# EAGLE design TG3_1 (EAGLE 7.7.0)
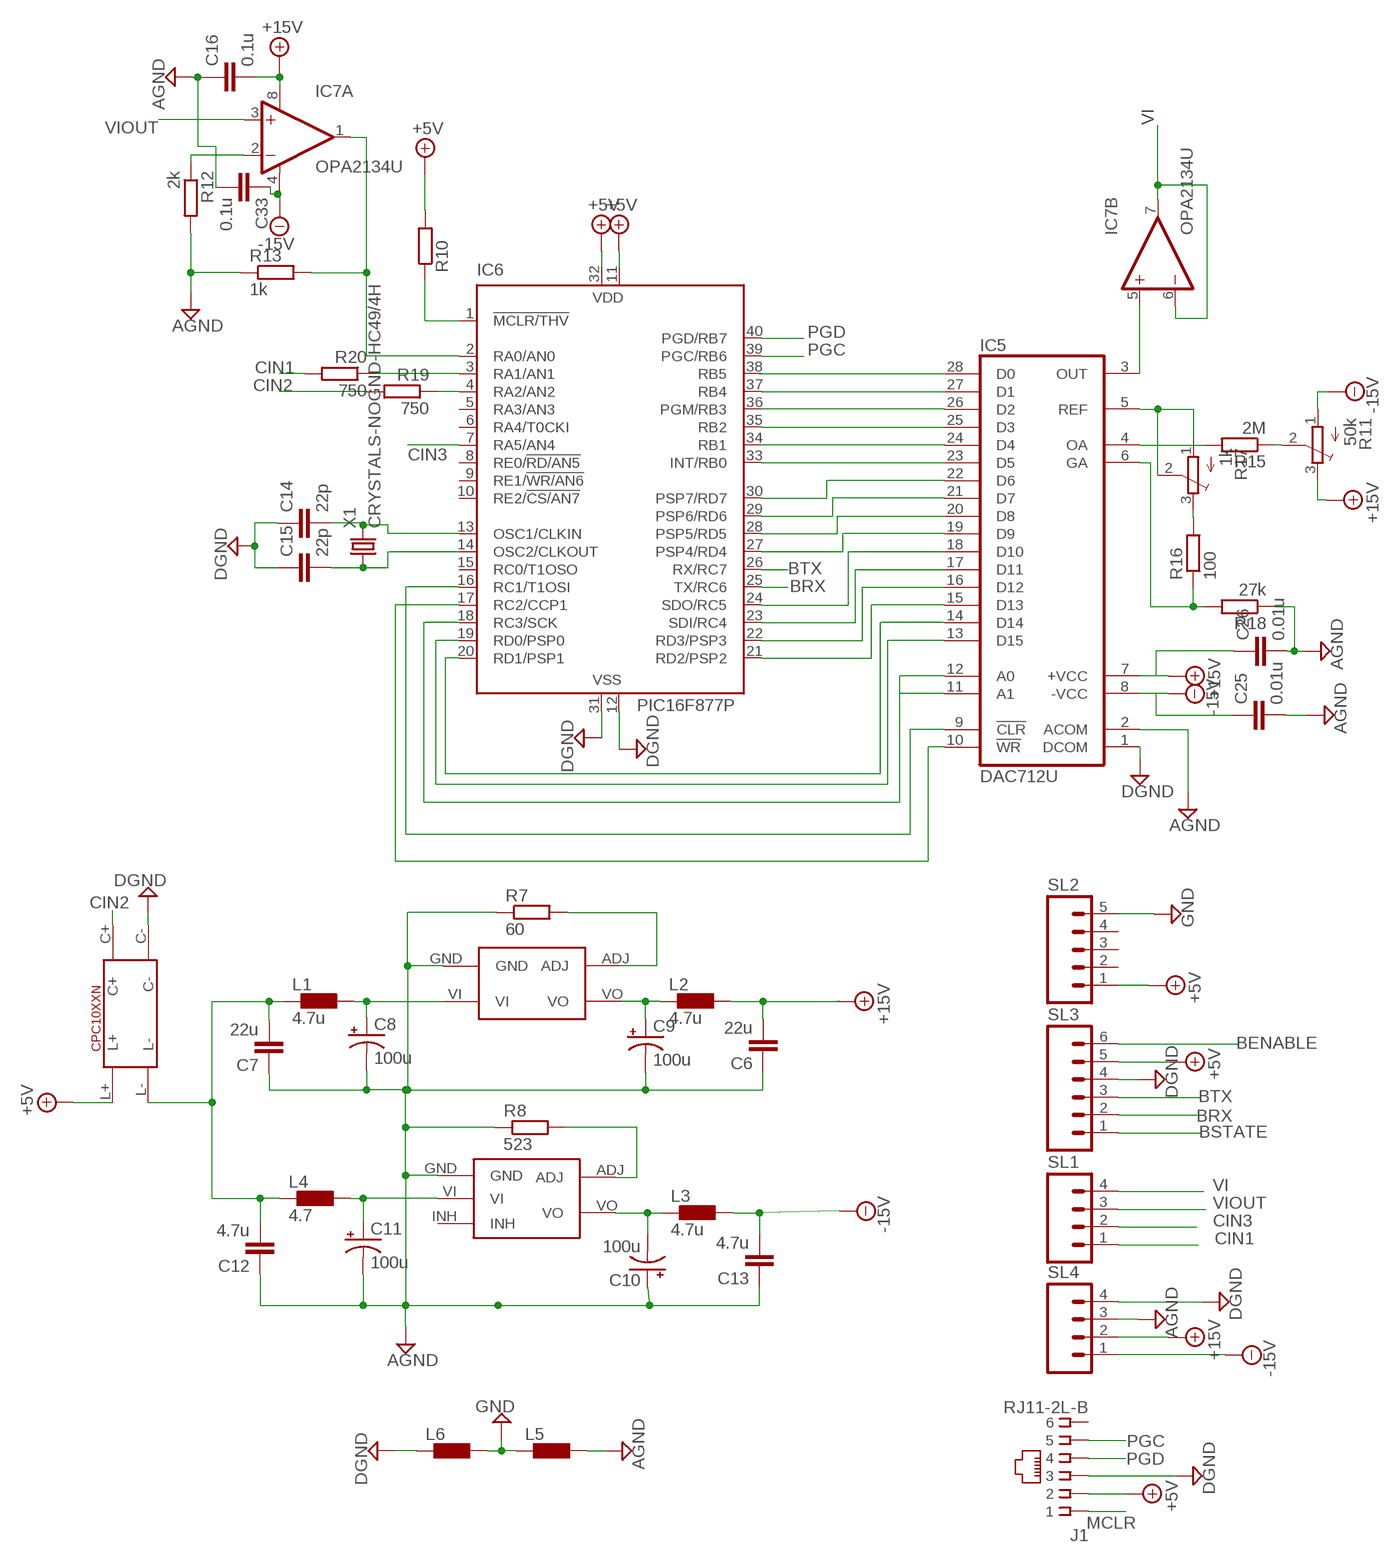
[diagram p0: schematic, sheet 1]

## Parts
C6  22u  C  [C0805]
C7  22u  C  [C0805]
C8  100u  CPOL-US150CLZ-0810  [150CLZ-0810]
C9  100u  CPOL-US150CLZ-0810  [150CLZ-0810]
C10  100u  CPOL-US150CLZ-0810  [150CLZ-0810]
C11  100u  CPOL-US150CLZ-0810  [150CLZ-0810]
C12  4.7u  C  [C0805]
C13  4.7u  C  [C0805]
C14  22p  C  [C0805]
C15  22p  C  [C0805]
C16  0.1u  C  [C0805]
C25  0.01u  C  [C0805]
C26  0.01u  C  [C0805]
C33  0.1u  C  [C0805]
IC5  DAC712U  [SO28-3]
IC6  PIC16F877P  [DIL40]
IC7  OPA2134U  [SO08]
J1  RJ11-2L-B  [RJ11-NO_SHIELD]
L1  4.7u  LL2012C  [L2012C]
L2  4.7u  LL2012C  [L2012C]
L3  4.7u  LL2012C  [L2012C]
L4  4.7  LL2012C  [L2012C]
L5  LL2012C  [L2012C]
L6  LL2012C  [L2012C]
R7  60  R  [R0805]
R8  523  R  [R0805]
R10  R  [R0805]
R11  50k  TRIM_EU-3223W  [3223W]
R12  2k  R  [R0805]
R13  1k  R  [R0805]
R15  2M  R  [R0805]
R16  100  R  [R0805]
R17  1k  TRIM_EU-3223W  [3223W]
R18  27k  R  [R0805]
R19  750  R  [R0805]
R20  750  R  [R0805]
SL1  M04  [04P]
SL2  M05  [05P]
SL3  M06  [06P]
SL4  M04  [04P]
U$1  PTN04050C  [PTN04050C]
U$2  PTN04050A  [PTN04050A]
U$6  CPC10XXN  [CPC10XXN]
X1  CRYSTALS-NOGND-HC49/4H  [HC49]

## Nets
+5V: IC6.11(VDD) IC6.32(VDD) J1.2 R10.2 SL2.1 SL3.5 U$6.L+
+15V: C6.2 C16.2 C26.1 IC5.7(+VCC) IC7.8(A:V+) L2.1 R11.3(E) SL4.2
-15V: C13.2 C25.1 C33.1 IC5.8(-VCC) IC7.4(A:V-) L3.1 R11.1(A) SL4.1
AGND: C6.1 C7.1 C8.- C9.- C10.+ C11.- C12.1 C13.1 C16.1 C25.2 C26.2 C33.2 IC5.2(ACOM) L5.1 R7.1 R8.1 R12.2 R13.1 R18.1 SL4.3 U$1.GND U$2.GND
BENABLE: SL3.6
BRX: IC6.25(TX/RC6) SL3.2
BSTATE: SL3.1
BTX: IC6.26(RX/RC7) SL3.3
CIN1: R20.2 SL1.1
CIN2: R19.2 U$6.C+
CIN3: IC6.7(RA5/AN4) SL1.2
DGND: C14.1 C15.1 IC5.1(DCOM) IC6.12(VSS) IC6.31(VSS) J1.3 L6.2 SL3.4 SL4.4 U$6.C-
GND: L5.2 L6.1 SL2.5
MCLR: IC6.1(!MCLR/THV) J1.1 R10.1
N$1: IC5.21(D7) IC6.29(PSP6/RD6)
N$3: R7.2 U$1.ADJ
N$4: IC5.22(D6) IC6.30(PSP7/RD7)
N$5: C9.+ L2.2 U$1.VO
N$6: IC5.23(D5) IC6.33(INT/RB0)
N$7: C8.+ L1.1 U$1.VI
N$8: C14.2 IC6.13(OSC1/CLKIN) X1.2
N$9: IC5.28(D0)
N$10: C15.2 IC6.14(OSC2/CLKOUT) X1.1
N$11: C11.+ L4.1 U$2.VI
N$12: IC5.24(D4) IC6.34(RB1)
N$13: IC5.25(D3) IC6.35(RB2)
N$14: IC5.26(D2) IC6.36(PGM/RB3)
N$15: C10.- L3.2 U$2.VO
N$17: R8.2 U$2.ADJ
N$18: IC6.3(RA1/AN1) R20.1
N$19: IC5.3(OUT) IC7.5(B:+IN)
N$20: IC6.4(RA2/AN2) R19.1
N$21: IC7.2(A:-IN) R12.1
N$22: IC5.27(D1) IC6.37(RB4)
N$30: IC5.20(D8) IC6.28(PSP5/RD5)
N$31: IC5.19(D9) IC6.27(PSP4/RD4)
N$32: IC5.18(D10) IC6.24(SDO/RC5)
N$33: IC5.17(D11) IC6.23(SDI/RC4)
N$34: IC5.16(D12) IC6.22(RD3/PSP3)
N$35: IC5.15(D13) IC6.21(RD2/PSP2)
N$36: IC5.14(D14) IC6.20(RD1/PSP1)
N$37: IC5.13(D15) IC6.19(RD0/PSP0)
N$38: IC5.11(A1) IC5.12(A0) IC6.18(RC3/SCK)
N$39: C7.2 C12.2 L1.2 L4.2 U$6.L-
N$40: IC5.9(!CLR) IC6.16(RC1/T1OSI)
N$41: IC5.10(!WR) IC6.17(RC2/CCP1)
N$44: R11.2(S) R15.1
N$47: IC5.4(OA) R15.2
N$48: IC5.5(REF) R17.1(A) R17.2(S)
N$49: R16.2 R17.3(E)
N$50: IC5.6(GA) R16.1 R18.2
PGC: IC6.39(PGC/RB6) J1.5
PGD: IC6.40(PGD/RB7) J1.4
VI: IC7.6(B:-IN) IC7.7(B:OUT) SL1.4
VIOUT: IC7.3(A:+IN) SL1.3
VIOUT_IN: IC6.2(RA0/AN0) IC7.1(A:OUT) R13.2
Unconnected: IC6.5(RA3/AN3) IC6.6(RA4/T0CKI) IC6.8(RE0/!RD/AN5) IC6.9(RE1/!WR/AN6) IC6.10(RE2/!CS/AN7) IC6.15(RC0/T1OSO) IC6.38(RB5) J1.6 SL2.2 SL2.3 SL2.4 U$2.INH

## Library data of the parts
C6 C7 C12-C16 C25 C26 C33 = eagle-ltspice:C: CAPACITOR, European symbol; SPICEMODEL: NONE; SPICEPREFIX: C
C8-C11 = resistor:CPOL-US: POLARIZED CAPACITOR, American symbol
IC5 = burr-brown:DAC712: 16-Bit DAC with 16-Bit Bus Interface; MF: TEXAS INSTRUMENTS; MPN: DAC712U; OC_FARNELL: 1097510; OC_NEWARK: 74C9132
IC6 = microchip:PIC16F87*: MICROCONTROLLER; MF: MICROCHIP; MPN: PIC16F877-04/P; OC_FARNELL: 9761349; OC_NEWARK: 61K3463
IC7 = burr-brown:OPA2134: Operational Amplifier; MF: TEXAS INSTRUMENTS; MPN: OPA2134UA; OC_FARNELL: 1206935; OC_NEWARK: 35C1847
J1 = con-tycoelectronics:RJ11: CORCOM Modular RJ Jacks No Shield Source: www.tycoelectronics.com .. ENG_DS_1654001_1099_RJ_L_0507.pdf; MF: TYCO ELECTRONICS; MPN: RJ11-2L-B; OC_FARNELL: unknown; OC_NEWARK: 83F4463
L1-L6 = eagle-ltspice:L: INDUCTOR, European symbol; SPICEMODEL: NONE; SPICEPREFIX: L
R7 R8 R10 R12 R13 R15 R16 R18-R20 = eagle-ltspice:R: RESISTOR, European symbol; SPICEMODEL: NONE; SPICEPREFIX: R
R11 R17 = pot:TRIM_EU-: POTENTIOMETER
SL1 SL4 = con-amp-quick:M04: AMP QUICK CONNECTOR; OC_FARNELL: unknown; OC_NEWARK: unknown
SL2 = con-amp-quick:M05: AMP QUICK CONNECTOR; OC_FARNELL: unknown; OC_NEWARK: unknown
SL3 = con-amp-quick:M06: AMP QUICK CONNECTOR; OC_FARNELL: unknown; OC_NEWARK: unknown
U$1 = Milib:PTN04050C
U$2 = Milib:PTN04050A
U$6 = Milib:CPC10XXN
X1 = IQD-Frequency-Products:CRYSTALS-NOGND: CRYSTALS CAN NOT GROUNDED

## Board
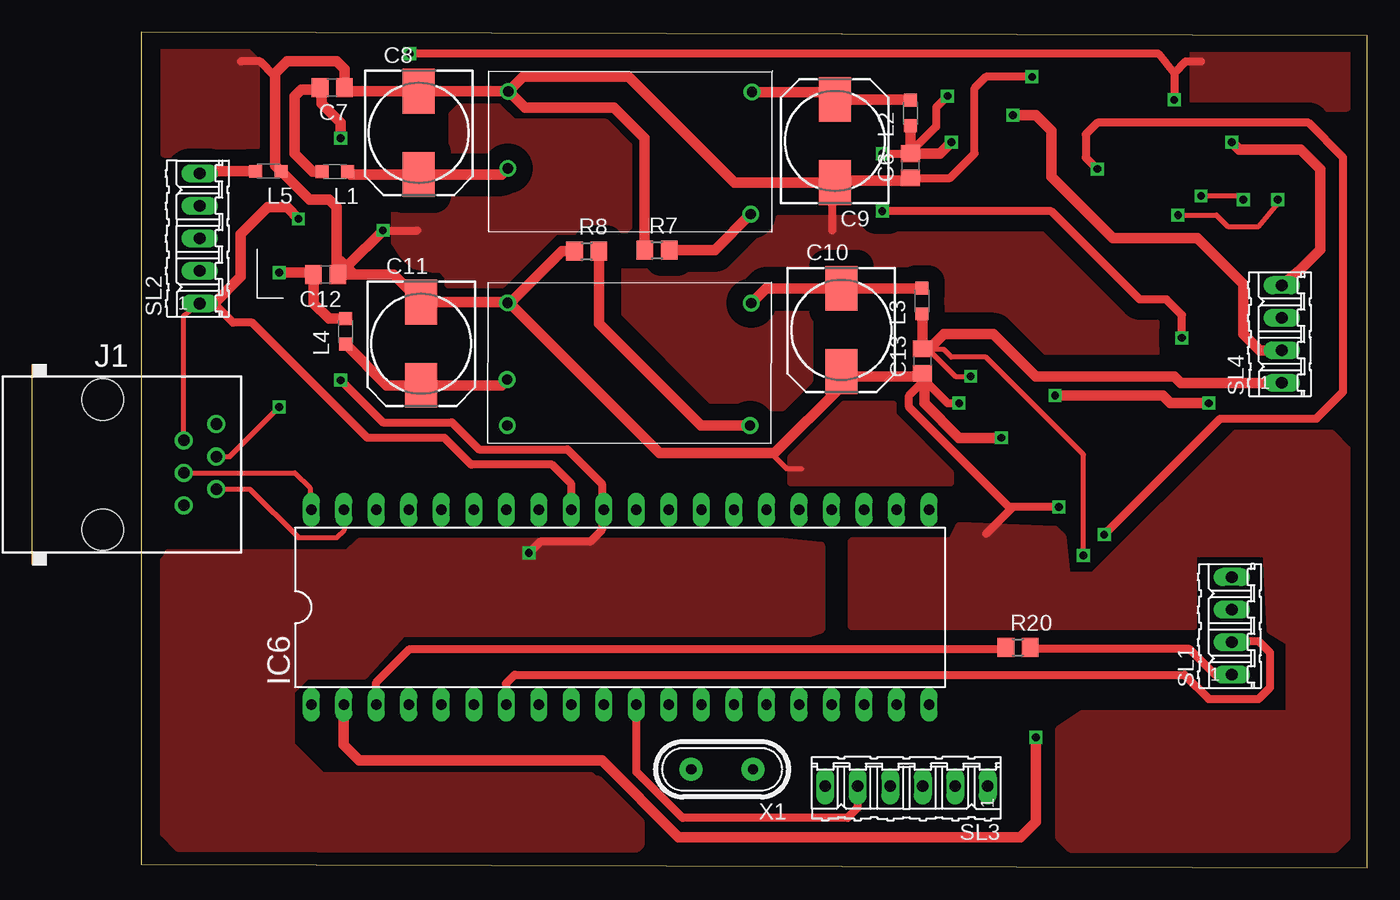
[diagram p1: board, top side]
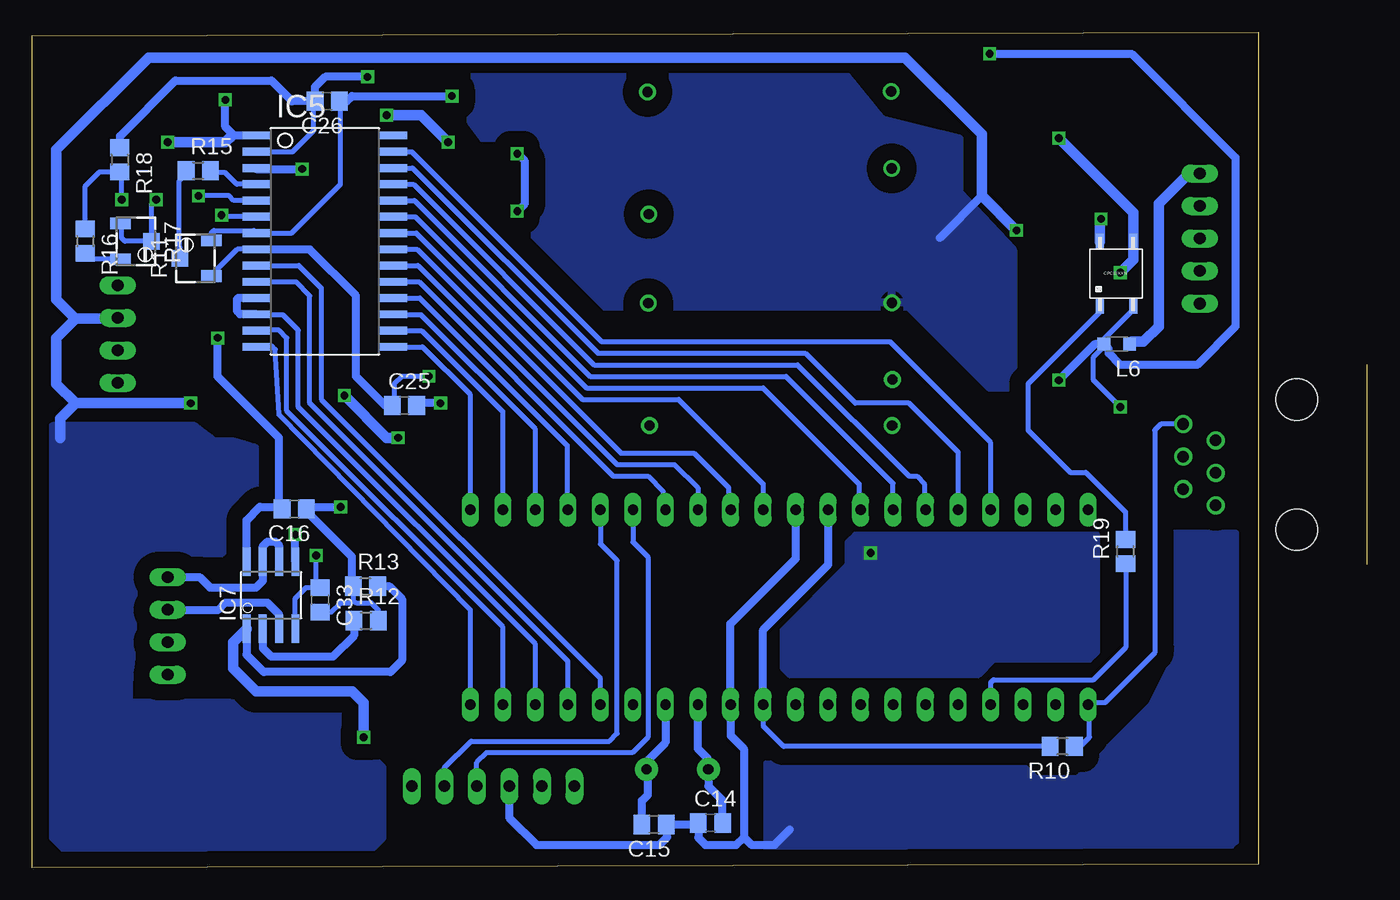
[diagram p2: board, bottom side, seen from below]

Size 95.8 x 65.3 mm. Coordinates in mm from the lower left corner, seen from the top.
Outline: 0,0.3 95.8,0 95.8,65 0,65.3 0,0.3
Copper layers (1*16): Top 0.035mm / dielectric 1.5mm / Bottom 0.035mm
Design rules "default": minimum track width 10mil, minimum drill 24mil, track to track 8mil, track to pad 8mil, pad to pad 8mil, via to via 8mil, smd to smd 8mil, copper to edge 40mil, drill to drill 8mil, minimum pad ring 10mil, minimum via ring 8mil, stop-mask expansion 4mil, vias tented up to drill 0mil, thermal gap 10mil

### Footprints (pad centres in the part's own frame; a part is rotated, then mirrored left to right if it is on the bottom)
C0805 = smd 1.3 x 1.5: 1 -0.95,0; 2 0.95,0
150CLZ-0810 = smd 3.5 x 2.5: + 3.25,0; - -3.25,0
SO28-3 = smd 0.61 x 2.21: 1 -8.255,-5.315; 2 -6.985,-5.315; 3 -5.715,-5.315; 4 -4.445,-5.315; 5 -3.175,-5.315; 6 -1.905,-5.315; 7 -0.635,-5.315; 8 0.635,-5.315; 9 1.905,-5.315; 10 3.175,-5.315; 11 4.445,-5.315; 12 5.715,-5.315; 13 6.985,-5.315; 14 8.255,-5.315; 15 8.255,5.315; 16 6.985,5.315; 17 5.715,5.315; 18 4.445,5.315; 19 3.175,5.315; 20 1.905,5.315; 21 0.635,5.315; 22 -0.635,5.315; 23 -1.905,5.315; 24 -3.175,5.315; 25 -4.445,5.315; 26 -5.715,5.315; 27 -6.985,5.315; 28 -8.255,5.315
DIL40 = drill 0.813 long: 1 -24.13,-7.62; 2 -21.59,-7.62; 3 -19.05,-7.62; 4 -16.51,-7.62; 5 -13.97,-7.62; 6 -11.43,-7.62; 7 -8.89,-7.62; 8 -6.35,-7.62; 9 -3.81,-7.62; 10 -1.27,-7.62; 11 1.27,-7.62; 12 3.81,-7.62; 13 6.35,-7.62; 14 8.89,-7.62; 15 11.43,-7.62; 16 13.97,-7.62; 17 16.51,-7.62; 18 19.05,-7.62; 19 21.59,-7.62; 20 24.13,-7.62; 21 24.13,7.62; 22 21.59,7.62; 23 19.05,7.62; 24 16.51,7.62; 25 13.97,7.62; 26 11.43,7.62; 27 8.89,7.62; 28 6.35,7.62; 29 3.81,7.62; 30 1.27,7.62; 31 -1.27,7.62; 32 -3.81,7.62; 33 -6.35,7.62; 34 -8.89,7.62; 35 -11.43,7.62; 36 -13.97,7.62; 37 -16.51,7.62; 38 -19.05,7.62; 39 -21.59,7.62; 40 -24.13,7.62
SO08 = smd 0.61 x 2.21: 1 -1.905,-2.616; 2 -0.635,-2.616; 3 0.635,-2.616; 4 1.905,-2.616; 5 1.905,2.616; 6 0.635,2.616; 7 -0.635,2.616; 8 -1.905,2.616
RJ11-NO_SHIELD = drill 0.9 pad 1.4: 1 -3.175,8.89; 2 -1.905,6.35; 3 -0.635,8.89; 4 0.635,6.35; 5 1.905,8.89; 6 3.175,6.35 | hole 3.251: -5.08,0; 5.08,0
L2012C = smd 1 x 1: 1 -1,0; 2 1,0
R0805 = smd 1.3 x 1.5: 1 -0.95,0; 2 0.95,0
3223W = smd 0.9 x 1.6: 1 -1.4,-1.215; 3 1.4,-1.215 | smd 1.3 x 1.3: 2 0,1.215
04P = drill 0.914 long: 1 -3.81,0; 2 -1.27,0; 3 1.27,0; 4 3.81,0
05P = drill 0.914 long: 1 -5.08,0; 2 -2.54,0; 3 0,0; 4 2.54,0; 5 5.08,0
06P = drill 0.914 long: 1 -6.35,0; 2 -3.81,0; 3 -1.27,0; 4 1.27,0; 5 3.81,0; 6 6.35,0
PTN04050C = drill 0.8: ADJ 2.765,-6.945; GND -16.17,2.64; VI -16.2,-3.365; VO 2.87,2.605
PTN04050A = drill 0.8: ADJ 2.765,-6.945; GND -16.17,2.64; INH -16.18,-6.96; VI -16.2,-3.365; VO 2.87,2.605
CPC10XXN = smd 0.635 x 1.27: C+ -1.2,-2.5; C- 1.4,-2.5; L+ -1.2,2.5; L- 1.4,2.5
HC49 = drill 0.813 pad 1.8: 1 -2.413,0; 2 2.413,0

### Placement (x,y rotation side)
C6  60.09,54.85 90 top
C7  14.94,60.94 180 top
C8  21.7,57.42 270 top
C9  54.2,56.78 90 top
C10  54.7,42.02 270 top
C11  21.89,40.95 270 top
C12  14.43,46.34 180 top
C13  61.04,39.59 90 top
C14  42.81,3.51 0 bottom
C15  47.21,3.39 180 bottom
C16  75.31,28.04 180 bottom
C25  66.71,36.11 0 bottom
C26  72.74,59.89 180 bottom
C33  73.29,20.93 270 bottom
IC5  72.93,48.96 270 bottom
IC6  37.43,20.36 0 top
IC7  77.14,21.3 0 bottom
J1  -3,31.5 270 top
L1  15.15,54.39 180 top
L2  60.09,58.97 90 top
L3  60.99,44.29 90 top
L4  15.99,41.91 90 top
L5  9.95,54.41 180 top
L6  11.07,40.91 180 bottom
R7  40.3,48.26 0 top
R8  34.81,48.19 0 top
R10  15.34,9.49 180 bottom
R11  83.02,47.63 90 bottom
R12  69.71,19.31 0 bottom
R13  69.76,22.01 0 bottom
R15  82.81,54.46 0 bottom
R16  91.64,48.96 270 bottom
R17  87.68,48.95 270 bottom
R18  88.94,55.31 270 bottom
R19  10.38,24.71 90 bottom
R20  68.51,17.23 0 top
SL1  85.2,18.9 90 top
SL2  4.58,49.17 90 top
SL3  59.79,6.38 180 top
SL4  89.1,41.7 90 top
U$1  44.86,58.01 0 top
U$2  44.8,41.51 0 top
U$6  11.19,46.42 0 bottom
X1  45.39,7.7 180 top

### Tracks (layer width: path | path; a pad name or v marks a point on that pad's centre or on a via)
+5V  (via drill 0.6)
  Top 0.406: J1.2 3.35,43.16 SL2.1
  Top 0.61: IC6.32 33.62,29.98 32.1,31.5 25.8,31.5 23.7,33.6 17.7,33.6 8.7,42.6 7.2,42.6 5.7,44.1 | SL3.5 55.98,4.68 55.2,3.9 42.3,3.9 38.7,7.5 IC6.11
  Top 0.813: v12.3,50.7 11.4,51.6 9.9,51.6 7.8,49.5 7.8,46.2 5.7,44.1 SL2.1
  Bottom 0.406: R10.2 37.09,9.49 38.7,11.1 IC6.11
  Bottom 0.61: IC6.32 33.62,23.68 38.7,18.6 IC6.11
  Bottom 0.813: U$6.L+ 12.39,50.61 v12.3,50.7
+15V  (via drill 0.6)
  Top 0.61: 60.09,57.9 L2.1 60.16,57.9 | 60,55.8 62.1,57.9 62.1,59.4 v63,60.3 | v81.3,41.4 81.3,43.2 80.1,44.4 78,44.4 71.1,51.3 v57.9,51.3 | v57.9,55.8 C6.2
  Top 0.813: C6.2 L2.1 | 60,55.8 C6.2 | v63.3,56.7 62.4,55.8 C6.2 | v68.1,58.8 69.9,58.8 71.1,57.6 71.1,54 75.9,49.2 82.5,49.2 86.1,45.6 86.1,41.7 87.37,40.43 SL4.2
  Bottom 0.406: IC5.7 75.51,49.59 71.7,53.4 71.7,59.8 C26.1 | 78.28,49.63 IC5.7 | R11.3 81.81,49.59 81.6,49.8 78.45,49.8 IC5.7
  Bottom 0.61: C26.1 71.21,59.89 70.8,60.3 v63,60.3 | IC7.8 79.05,27.15 78,28.2 76.8,28.2 | 76.8,28.2 76.4,28.2 C16.2 | 76.8,28.2 76.5,27.9 76.5,33.6 81.3,38.4 v81.3,41.4 | v57.9,51.3 57.3,51.9 57.3,55.2 v57.9,55.8
  Bottom 0.813: v63.3,56.7 65.4,58.8 v68.1,58.8
-15V  (via drill 0.6)
  Top 0.406: v73.61,24.41 73.61,32.29 66,39.9 63.3,39.9 62.7,40.5 61.5,40.5 | 61.38,40.2 C13.2 61.3,40.8 | 61.38,40.2 61.2,40.2 | 61.38,40.2 61.5,40.5 | 61.5,40.5 63.6,38.4 v64.8,38.4
  Top 0.813: L3.1 61.04,43.24 C13.2 61.08,40.5 61.5,40.5 62.7,41.7 66.6,41.7 69.9,38.4 80.7,38.4 81.21,37.89 SL4.1
  Bottom 0.406: IC5.8 79.78,48.32 81.81,46.3 R11.1 | IC7.4 75.23,21.06 74.4,21.9 73.61,21.9 | 73.61,21.9 C33.1 | 73.61,21.9 v73.61,24.41 | v64.8,38.4 66.9,38.4 67.5,37.8 67.5,36.27 C25.1
  Bottom 0.61: C25.1 68.21,36.11 70.5,38.4 70.5,44.7 74.1,48.3 78.22,48.3 IC5.8
AGND  (via drill 0.6)
  Top 0.406: 16.2,46.5 16.5,46.5 | 16.5,46.5 17.7,46.5 18.3,46.2 17.1,46.2 16.5,46.5 | 15.9,46.5 15.3,47.7 | 49.2,32.4 50.4,31.2 51.6,31.2
  Top 0.61: C13.1 61.04,38.26 61.2,38.1 | 61.2,38.1 63,36.3 v63.9,36.3 | C6.1 63.2,53.9 65.1,55.8 65.1,60.9 66,61.8 v69.6,61.8 | 68.1,28.2 67.8,28.2 60,36 60,36.9 61.2,38.1 | v18.9,49.8 21.6,49.8 | 54,53.7 54,53.4 | 54,49.8 54,53.4 | 54,53.4 54.3,53.7 56.7,53.7 | 10.5,58.5 10.5,61.8 9.3,63 7.8,63 | v71.7,28.2 68.1,28.2 | 68.1,28.2 66,26.1
  Top 0.813: C12.1 15.3,46.42 15.3,47.7 15.3,51.6 14.7,52.2 13.16,52.2 L5.1 10.5,54.86 10.5,58.5 10.5,62.1 11.4,63 15.3,63 15.89,62.41 C7.1 16.16,60.67 C8.- 28.67,60.67 U$1.GND | C12.1 19.75,46.34 C11.- 28.58,44.2 U$2.GND | U$1.GND 28.74,60.6 28.8,60.6 30,59.4 36.95,59.4 39.35,57 R7.1 | C10.+ 54.7,37.6 | 54.7,37.6 49.5,32.4 49.2,32.4 40.5,32.4 28.75,44.15 U$2.GND | U$2.GND 28.85,44.15 32.89,48.19 R8.1 | U$1.GND 29.84,61.8 38.1,61.8 46.37,53.53 C9.- 54.37,53.7 56.7,53.7 59.89,53.7 C6.1 | 54.7,37.6 55.2,38.1 54.9,38.4 60.8,38.4 C13.1 | v18.9,49.8 16.2,47.1 16.14,47.1 C12.1 | 16.5,46.5 15.6,47.4 15.6,46.5 15.9,46.5 16.2,46.5 | v67.2,33.6 63.9,33.6 61.2,36.3 61.2,38.1 61.2,38.7 | v71.4,36.9 79.8,36.9 80.4,36.3 v83.4,36.3
  Bottom 0.406: IC5.2 75.46,55.95 73.8,57.6 73.8,59.78 C26.2 | 88.93,55.95 R18.1 | R13.1 70.71,20.91 | 70.71,20.91 70.5,20.7 69.3,20.7 68.76,20.16 R12.2 | C33.2 72.42,19.98 71.7,20.7 70.92,20.7 70.71,20.91
  Bottom 0.61: v63.9,36.3 65.65,36.3 C25.2 | v69.6,61.8 72.9,61.8 73.69,61.01 C26.2 75.49,59.89 77.1,61.5 84.6,61.5 88.93,57.17 88.93,55.95 | R13.1 70.8,22.1 70.8,24.3 74.1,27.6 74.22,27.9 C16.1 73.94,28.04 74.1,28.2 v71.7,28.2 | 92.4,42.9 92.54,43.04 | 21.6,52.5 24.9,49.2 | 89.77,42.9 SL4.3
  Bottom 0.813: 92.54,43.04 93.9,44.4 93.9,56.1 86.7,63.3 27.6,63.3 21.6,57.3 21.6,52.5 v18.9,49.8 | 92.4,36.3 93.9,37.8 93.9,41.4 92.4,42.9 89.77,42.9 | 92.4,36.3 v83.4,36.3 | v71.4,36.9 68.1,33.6 v67.2,33.6 | 92.4,36.3 93.6,35.1 93.6,33.6
  pour Top (isolate 1.27, rank 2): 19.8,48.9 20.4,48 21.3,47.1 22.8,46.8 23.4,46.8 24,46.2 24,45.6 28.2,45.6 32.4,49.8 37.8,49.8 38.1,50.1 38.1,56.4 36.3,58.2 29.1,58.2 27.9,59.4 24.9,59.4 24.3,58.8 24.3,56.1 25.2,55.2 27.3,55.2 28.2,56.1 29.4,56.1 30.3,55.2 30.3,53.4 29.7,52.8 24.6,52.8 23.4,51.6 19.8,51.9
  pour Top (isolate 1.27, rank 2): 37.5,46.5 37.5,42.6 44.1,36 50.1,36 52.2,38.1 52.2,43.2 49.2,43.2 48.3,42.3 47.1,42.3 45.6,43.8 45.6,44.4 48,46.8 51.9,46.8 52.8,47.7 56.4,47.7 57,47.1 61.2,47.1 62.7,45.6 62.7,43.8 63.6,42.9 67.2,42.9 69,41.1 69.9,40.2 79.2,40.2 80.1,41.1 80.1,42.6 79.5,43.2 77.4,43.2 70.5,50.1 59.1,50.1 58.8,49.8 57,49.8 56.1,50.7 49.8,50.7 48.3,49.2 47.1,49.2 45,47.1 43.2,47.1 42.6,46.5
  pour Top (isolate 1.27, rank 2): 1.8,55.8 8.4,55.8 9,56.4 9,63 8.1,63.9 1.8,63.9
  pour Bottom (isolate 1.27, rank 2): 81.6,33.3 81.9,33.6 83.1,34.5 94.2,34.5 94.2,2.4 93.3,1.5 69.3,1.5 68.4,2.4 68.4,7.8 69,8.4 70.5,8.4 71.7,9.6 71.7,12 72.3,12.6 80.4,12.9 88.2,12.9 88.2,14.4 87.3,23.7 86.4,24.6 81,24.6 80.1,25.5 80.1,27.9 78.6,29.4 78.3,29.4 78,29.7 78,32.7 80.1,33.3
  pour Bottom (isolate 1.27, rank 2): 60.6,57 61.5,58.2 61.5,61.8 32.1,61.8 29.4,58.5 23.4,57 23.4,52.8 19.2,48.3 19.2,37.5 21,37.5 27.3,43.8 51,43.8 56.7,49.5 56.1,50.1 56.4,57
  pour Top: 50.7,30.3 50.7,32.1 54.9,36.3 55.8,36.3 58.8,36.3 58.8,35.4 63.3,30.9 63.3,30 50.7,30
  pour Top: 55.5,25.5 55.5,18.9 82.2,18.9 82.2,24.6 87.9,24.6 88.2,18.6 89.7,17.7 89.7,12 73.5,12 71.7,10.8 71.7,2.4 72.6,1.5 93.3,1.5 94.2,2.4 94.2,32.7 93,33.9 85.5,33.9 74.4,22.8 72.3,22.8 72,25.8 71.4,26.4 63.9,26.7 63.3,25.5
BRX
  Bottom 0.406: SL3.2 63.6,7.8 61.5,9.9 50.7,9.9 50.1,10.5 50.1,24 51.4,25.3 IC6.25
BTX
  Bottom 0.406: IC6.26 48.86,25.46 47.7,24.3 47.7,10.2 48.9,9 60.3,9 61.06,8.24 SL3.3
CIN1
  Top 0.61: R20.2 69.59,17.1 81.9,17.1 83.91,15.09 SL1.1
CIN2
  Bottom 0.406: U$6.C+ 12.39,43.41 18,37.8 18,34.2 14.7,30.9 13.5,30.9 10.38,27.78 R19.2
CIN3
  Top 0.61: IC6.7 28.5,12.78 28.5,14.4 29.19,15.09 81.51,15.09 83.4,13.2 87.3,13.2 88.2,14.1 88.2,16.8 87.3,17.7 85.27,17.7 SL1.2
DGND  (via drill 0.6)
  Top 0.406: J1.3 6.94,32.13 v10.8,36
  Top 0.61: 80.7,62.1 79.5,63.6 v21,63.6 | v15.6,38.1 18.9,34.8 24.3,34.8 26.4,32.7 33.3,32.7 36,30 36,28.14 | 36,28.14 IC6.31 | 80.7,62.1 v80.7,60 | 80.7,62.1 81.6,63 82.8,63 | 36,28.14 36,26.4 35.1,25.5 31.2,25.5 v30.3,24.6
  Top 0.813: SL4.4 90.51,46.71 92.1,48.3 92.1,54.6 90.6,56.1 85.8,56.1 v85.2,56.7
  Bottom 0.406: U$6.C- 9.79,43.61 12.07,41.33 L6.2 12.3,40.68 12.3,40.5 12.9,39.9 12.9,38.1 v10.8,36
  Bottom 0.61: 41.24,19.06 36.16,24.14 IC6.31 | IC5.1 80.02,57.21 | 80.02,57.21 80.7,57.9 v80.7,60 | v21,63.6 9.9,63.6 1.8,55.5 1.8,42.3 4.8,39.3 10.8,39.3 11.7,40.2 11.7,40.54 L6.2 12.79,40.91 v15.6,38.1 | SL3.4 58.52,3.92 56.4,1.8 46.8,1.8 46.2,2.4 46.2,3.33 C15.1 43.88,3.39 C14.1 43.76,2.36 43.2,1.8 40.8,1.8 40.2,2.4 | 41.24,19.06 41.26,19.06 | 41.24,19.06 IC6.12 41.24,10.34 40.2,9.3 40.2,2.4 | 40.2,2.4 39.6,1.8 37.8,1.8 36.6,3 | 80.4,57 80.23,57 80.02,57.21
  Bottom 0.813: v85.2,56.7 80.7,56.7 80.4,57
  pour Top (isolate 1.27, rank 2): 82.2,63.6 82.2,59.4 94.2,59.4 94.2,63.9 82.2,63.9
  pour Bottom (isolate 1.27, rank 2): 38.4,8.1 38.4,1.5 2.4,1.5 1.8,2.1 1.8,26.1 6.6,26.1 6.3,16.8 8.4,12.6 14.1,6.9 17.4,6.9 18.6,8.1
  pour Top: 35.4,6.9 35.7,6.9 39,3.6 39,1.8 38.7,1.5 3,1.5 1.8,2.7 1.8,24 2.1,24.3 2.1,24.6 16.2,24.6 17.1,25.5 50.1,25.5 53.1,25.2 53.1,18.6 52.2,18.3 20.4,18.3 17.4,15 12.9,15 11.7,13.8 11.7,9.6 14.1,7.2 35.1,7.2
  pour Bottom: 12.6,16.8 13.2,16.2 20.7,16.2 21.9,15 36.6,15 37.2,15.6 37.2,18.6 32.1,23.7 32.1,25.5 31.5,26.1 12.6,26.1
GND
  Top 0.813: L5.2 4.74,54.41 SL2.5
  Bottom 0.813: SL2.5 5.45,54.25 7.8,51.9 7.8,42.3 9,41.1 9.88,41.1 L6.1
MCLR
  Bottom 0.406: R10.1 13.91,9.49 13.2,10.2 13.2,12.64 IC6.1 13.14,12.9 12,12.9 8.1,16.8 8.1,34.2 7.62,34.67 J1.1
N$1
  Bottom 0.406: IC5.21 65.73,48.32 49.8,32.4 44.1,32.4 41.4,29.7 41.4,28.14 IC6.29
N$3
  Top 0.813: R7.2 44.82,48.26 U$1.ADJ
N$4
  Bottom 0.406: IC5.22 65.8,49.59 52.8,36.6 45.3,36.6 38.7,30 IC6.30
N$5
  Top 0.813: U$1.VO 53.62,60.62 C9.+ 60.03,60.03 L2.2
N$6
  Bottom 0.406: IC5.23 65.87,50.87 52.5,37.5 38.7,37.5 31.2,30 31.2,28.1 IC6.33
N$7
  Top 0.813: U$1.VI 28.18,54.17 C8.+ 16.37,54.17 L1.1
N$8
  Bottom 0.61: IC6.13 43.8,12.72 43.8,9.3 42.98,8.48 X1.2 42.98,6.38 41.86,5.26 C14.2
N$10
  Bottom 0.61: C15.2 48.16,5.24 47.7,5.7 47.7,7.6 X1.1 47.8,8.3 46.32,9.78 IC6.14
N$11
  Top 0.813: U$2.VI 28.15,37.7 C11.+ 19.2,37.7 L4.1
N$12
  Bottom 0.406: IC5.24 65.94,52.13 52.2,38.4 36.9,38.4 28.54,30.04 IC6.34
N$13
  Bottom 0.406: IC5.25 66.01,53.41 51.9,39.3 36,39.3 27.3,30.6 26.7,30.6 26.1,30 26.1,28.08 IC6.35
N$14
  Bottom 0.406: IC5.26 66.08,54.67 51.6,40.2 35.4,40.2 31.5,36.3 27.3,36.3 23.46,32.46 IC6.36
N$15
  Top 0.813: U$2.VO 48.82,45.27 C10.- 60.97,45.27 L3.2
N$17
  Top 0.813: R8.2 35.76,42.54 43.73,34.56 U$2.ADJ
N$18
  Top 0.61: IC6.3 18.38,14.48 21,17.1 67.43,17.1 R20.1
N$19  (via drill 0.6)
  Top 0.61: v75.23,26.04 84.3,35.1 91.8,35.1 93.9,37.2 93.9,55.5 91.2,58.2 74.7,58.2 73.8,57.3 73.8,55.5 v74.7,54.6
  Bottom 0.406: IC5.3 78.08,54.67 78,54.6 78.3,54.6
  Bottom 0.61: 78.3,54.6 v74.7,54.6 | IC7.5 v75.23,26.04
N$20
  Bottom 0.406: IC6.4 20.92,14.48 20.7,14.7 12.9,14.7 10.38,17.22 R19.1
N$21
  Bottom 0.61: R12.1 70.66,18.14 72.3,16.5 77.1,16.5 77.78,17.17 IC7.2
N$22
  Bottom 0.406: IC6.37 20.92,33.22 28.8,41.1 51.3,41.1 66.15,55.95 IC5.27
N$30
  Bottom 0.406: IC5.20 65.66,47.05 50.1,31.5 45.6,31.5 43.8,29.7 43.8,28 IC6.28
N$31
  Bottom 0.406: IC5.19 65.59,45.78 50.4,30.6 47.7,30.6 46.5,29.4 46.5,28.16 IC6.27
N$32
  Bottom 0.406: IC5.18 65.52,44.52 54,33 54,28.04 IC6.24
N$33
  Bottom 0.406: IC6.23 56.48,34.28 65.4,43.2 67.57,43.2 IC5.17
N$34
  Bottom 0.406: IC5.16 65.38,41.98 59.02,35.62 IC6.22
N$35
  Bottom 0.406: IC6.21 61.56,36.96 65.31,40.7 IC5.15
N$36
  Bottom 0.406: IC6.20 61.56,20.16 76.5,35.4 76.8,40.5 77.1,40.8 77.2,40.7 IC5.14
N$37
  Bottom 0.406: IC6.19 59.02,18.82 75.9,35.7 75.9,41.4 76.5,42 78.22,42 IC5.13
N$38
  Bottom 0.406: IC6.18 56.48,17.48 75,36 75,42 76.2,43.2 78.2,43.2 IC5.12
  Bottom 0.61: IC5.11 79.69,44.52 79.8,44.4 79.8,43.5 79.55,43.24 IC5.12
N$39  (via drill 0.6)
  Top 0.813: L4.2 14.69,42.91 13.5,44.1 13.5,46.32 C12.2 13.48,46.5 v10.8,46.5 | v15.6,57 15.6,58.2 14.1,59.7 14.1,60.83 C7.2 13.85,60.8 12.5,60.8 12,60.3 12,55.8 13.41,54.39 L1.2
  Bottom 0.813: v15.6,57 9.79,51.19 U$6.L- 9.79,47.51 v10.8,46.5
N$40
  Bottom 0.406: IC5.9 74.96,47.05 73.2,45.3 73.2,36.6 51.4,14.8 IC6.16
N$41
  Bottom 0.406: IC6.17 53.94,16.14 74.1,36.3 74.1,44.7 75.19,45.78 IC5.10
N$44
  Bottom 0.406: R15.1 83.76,54.24 84.3,53.7 84.3,48.89 R11.2
N$47
  Bottom 0.406: IC5.4 79.81,53.41 80.7,54.3 81.7,54.3 R15.2
N$48  (via drill 0.6)
  Top 0.406: v82.8,52.5 85.8,52.5 v86.1,52.2
  Bottom 0.406: 78.25,52.25 IC5.5 80.04,52.13 80.4,52.5 v82.8,52.5 | v86.1,52.2 86.47,51.84 R17.2 88.55,48.95 88.8,49.2 88.8,49.95 R17.1
N$49
  Bottom 0.406: R17.3 91.18,47.55 R16.2
N$50  (via drill 0.6)
  Top 0.406: v81,51 84,51 84.9,50.1 87.3,50.1 88.8,51.9 v88.8,52.2
  Bottom 0.406: R16.1 91.64,53.26 90.54,54.36 R18.2 88.8,53.92 v88.8,52.2 | IC5.6 81.17,50.87 v81,51
PGC
  Top 0.406: J1.5 8.51,29.59 12.3,25.8 15.3,25.8 15.9,26.4 15.9,27.92 IC6.39
PGD
  Top 0.406: J1.4 12.04,30.86 13.2,29.7 13.2,28.08 IC6.40
VI
  Bottom 0.61: IC7.6 76.5,25.2 76.8,25.5 77.4,25.5 77.78,25.12 IC7.7 77.78,22.42 78.3,21.9 81.9,21.9 82.71,22.71 SL1.4
VIOUT
  Bottom 0.61: IC7.3 76.51,19.8 77.4,20.7 80.7,20.7 81.23,20.17 SL1.3
VIOUT_IN  (via drill 0.6)
  Top 0.813: IC6.2 15.84,9.6 17.04,8.4 36,8.4 42,2.4 68.7,2.4 69.9,3.6 v69.9,10.2
  Bottom 0.61: R13.2 67.91,22.01 66.9,21 66.9,16.2 67.8,15.3 77.7,15.3 79.05,16.64 IC7.1
  Bottom 0.813: v69.9,10.2 69.9,12.9 70.8,13.8 78.3,13.8 80.1,15.6 80.1,17.63 IC7.1